# Altium schematic sheet 03200904张晨.SchDoc
size A4; SheetNumber: 1; SheetTotal: 1
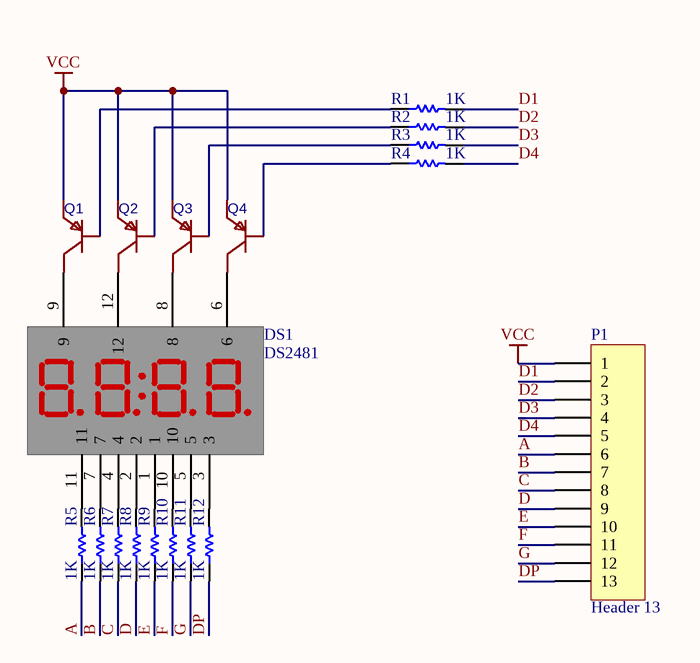
[diagram p0: 03200904张晨.SchDoc]

## Parts
DS1  DS2481  [DS2481]
P1  Header 13  [HDR1X13]
Q1  SS8550_C541706  [SOT-23-3]  (value not drawn)
Q2  SS8550_C541706  [SOT-23-3]  (value not drawn)
Q3  SS8550_C541706  [SOT-23-3]  (value not drawn)
Q4  SS8550_C541706  [SOT-23-3]  (value not drawn)
R1  value 1K  [R0603]  (hidden comment: Res1)
R2  value 1K  [R0603]  (hidden comment: Res1)
R3  value 1K  [R0603]  (hidden comment: Res1)
R4  value 1K  [R0603]  (hidden comment: Res1)
R5  value 1K  [R0603]  (hidden comment: Res1)
R6  value 1K  [R0603]  (hidden comment: Res1)
R7  value 1K  [R0603]  (hidden comment: Res1)
R8  value 1K  [R0603]  (hidden comment: Res1)
R9  value 1K  [R0603]  (hidden comment: Res1)
R10  value 1K  [R0603]  (hidden comment: Res1)
R11  value 1K  [R0603]  (hidden comment: Res1)
R12  value 1K  [R0603]  (hidden comment: Res1)

## Nets
VCC: P1.1 Q1.2(E) Q2.2(E) Q3.2(E) Q4.2(E)
A: P1.6 R5.1
B: P1.7 R6.1
C: P1.8 R7.1
D: P1.9 R8.1
D1: P1.2 R1.2
D2: P1.3 R2.2
D3: P1.4 R3.2
D4: P1.5 R4.2
DP: P1.13 R12.1
E: P1.10 R9.1
F: P1.11 R10.1
G: P1.12 R11.1
NetDS1_1: DS1.1 R9.2
NetDS1_2: DS1.2 R8.2
NetDS1_3: DS1.3 R12.2
NetDS1_4: DS1.4 R7.2
NetDS1_5: DS1.5 R11.2
NetDS1_6: DS1.6 Q4.3(C)
NetDS1_7: DS1.7 R6.2
NetDS1_8: DS1.8 Q3.3(C)
NetDS1_9: DS1.9 Q1.3(C)
NetDS1_10: DS1.10 R10.2
NetDS1_11: DS1.11 R5.2
NetDS1_12: DS1.12 Q2.3(C)
NetQ1_1: Q1.1(B) R1.1
NetQ2_1: Q2.1(B) R2.1
NetQ3_1: Q3.1(B) R3.1
NetQ4_1: Q4.1(B) R4.1

## Library data of the parts
P1 = Header 13: Header, 13-Pin; LatestRevisionDate: 17-Jul-2002; LatestRevisionNote: Re-released for DXP Platform.; Publisher: Altium Limited
Q1-Q4 = SS8550_C541706: BOM_Manufacturer: AnBon; BOM_Manufacturer Part: SS8550; Contributor: LCSC; BOM_Supplier: LCSC; BOM_Supplier Part: C541706; BOM_JLCPCB Part Class: Extended Part; spicePre: Q; spiceSymbolName: SS8550_C541706
R1-R12 = Res: Resistor; Published: 8-Jun-2000; LatestRevisionDate: 17-Jul-2002; LatestRevisionNote: Re-released for DXP Platform.; PackageReference: AXIAL-0.3; Publisher: Altium Limited; PackageDescription: Axial Device, Thru-Hole; 2 Leads; 0.3 in Pin Spacing